# EAGLE design SensX3N (EAGLE 8.1.1)
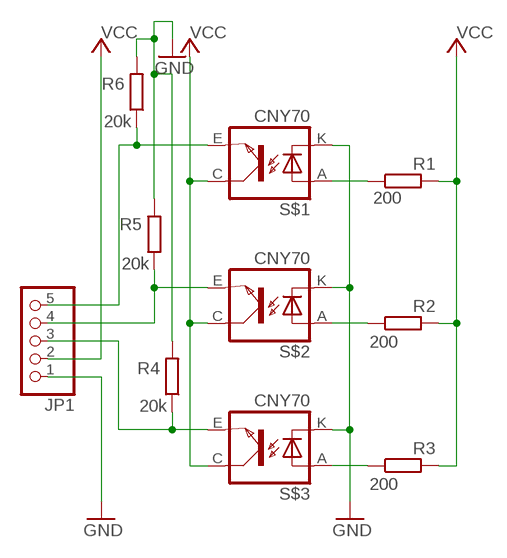
[diagram p0: schematic, sheet 1]

## Parts
JP1  PINHD-1X5  [1X05]
R1  200  R-EU_R0805  [R0805]
R2  200  R-EU_R0805  [R0805]
R3  200  R-EU_R0805  [R0805]
R4  20k  R-EU_R0805  [R0805]
R5  20k  R-EU_R0805  [R0805]
R6  20k  R-EU_R0805  [R0805]
S$1  CNY70  [4]
S$2  CNY70  [4]
S$3  CNY70  [4]

## Nets
GND: JP1.1 R4.2 R5.2 R6.2 S$1.K(C) S$2.K(C) S$3.K(C)
N$1: JP1.5 R6.1 S$1.E(EMI)
N$2: JP1.4 R5.1 S$2.E(EMI)
N$3: JP1.3 R4.1 S$3.E(EMI)
N$8: R2.1 S$2.A
N$9: R1.1 S$1.A
N$11: R3.1 S$3.A
VCC: JP1.2 R1.2 R2.2 R3.2 S$1.C(COL) S$2.C(COL) S$3.C(COL)

## Library data of the parts
JP1 = pinhead:PINHD-1X5: PIN HEADER
R1-R6 = resistor:R-EU_: RESISTOR, European symbol
S$1-S$3 = cny70:CNY70

## Board
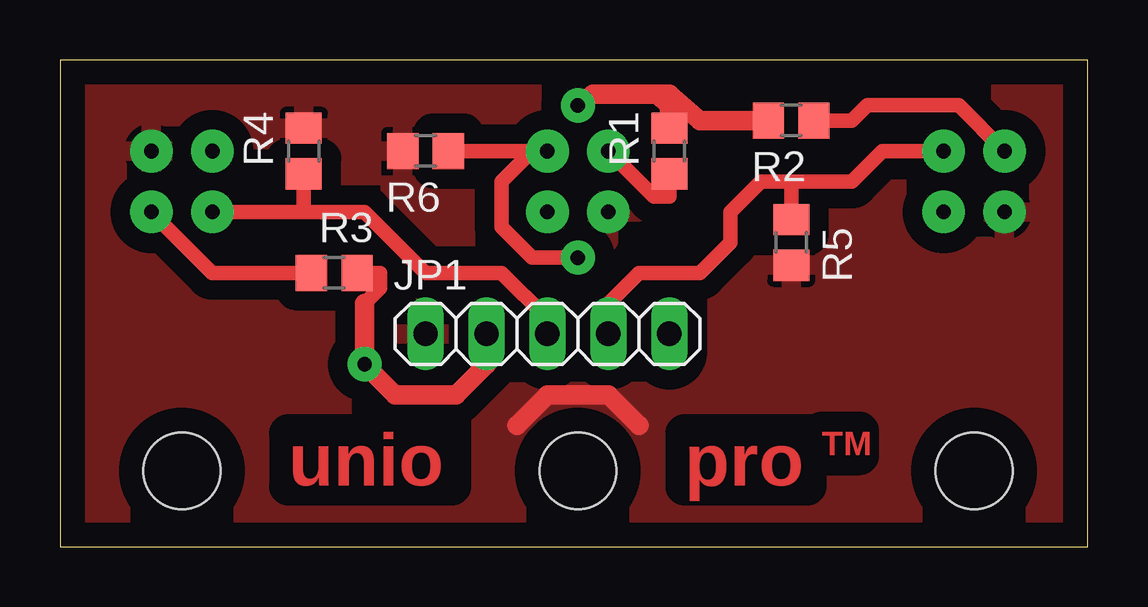
[diagram p1: board, top side]
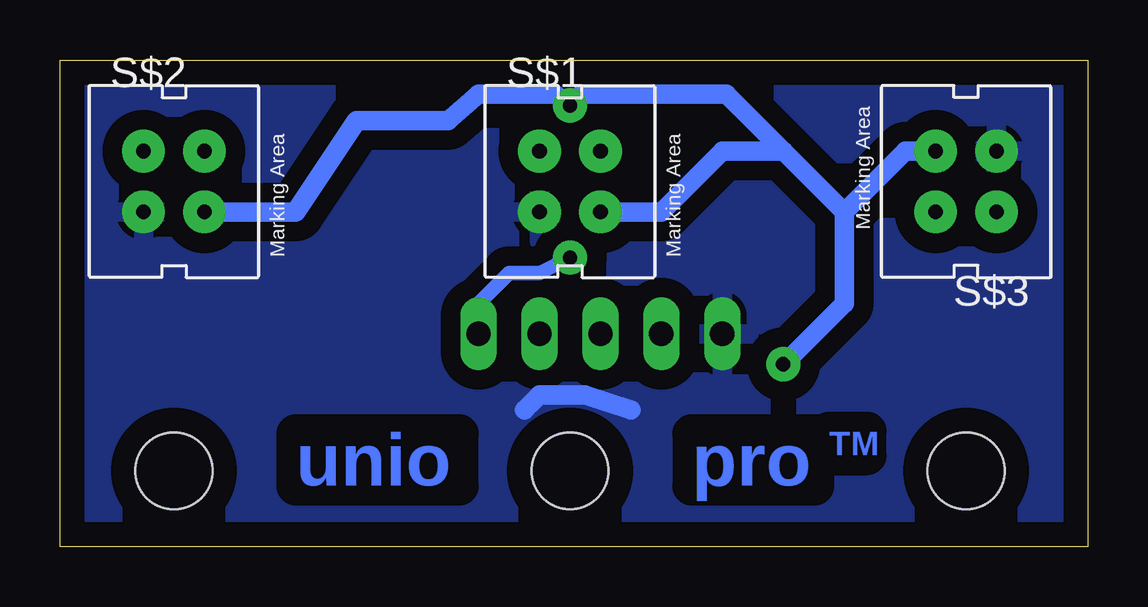
[diagram p2: board, bottom side, seen from below]

Size 42.85 x 20.31 mm. Coordinates in mm from the lower left corner, seen from the top.
Outline: 0,0 42.85,0 42.85,20.31 0,20.31 0,0
Copper layers (1*16): Top 0.035mm / dielectric 1.5mm / Bottom 0.035mm
Design rules "default": minimum track width 10mil, minimum drill 24mil, track to track 8mil, track to pad 8mil, pad to pad 8mil, via to via 8mil, smd to smd 8mil, copper to edge 40mil, drill to drill 8mil, minimum pad ring 10mil, minimum via ring 8mil, stop-mask expansion 4mil, vias tented up to drill 0mil, thermal gap 10mil
Holes 3.2 mm at 5.08,3.17 21.59,3.17 38.1,3.17

### Footprints (pad centres in the part's own frame; a part is rotated, then mirrored left to right if it is on the bottom)
1X05 = drill 1.016 long: 1 -5.08,0; 2 -2.54,0; 3 0,0; 4 2.54,0; 5 5.08,0
R0805 = smd 1.3 x 1.5: 1 -0.95,0; 2 0.95,0
4 = drill 0.61 pad 1.778: A -1.27,1.27; C 1.27,-1.27; E 1.27,1.27; K -1.27,-1.27

### Placement (x,y rotation side)
JP1  20.32,8.89 0 top
R1  25.4,16.51 90 top
R2  30.48,17.78 180 top
R3  11.43,11.43 0 top
R4  10.16,16.51 90 top
R5  30.48,12.7 270 top
R6  15.24,16.51 180 top
S$1  21.59,15.24 0 bottom
S$2  38.1,15.24 0 bottom
S$3  5.08,15.24 180 bottom

### Tracks (layer width: path | path; a pad name or v marks a point on that pad's centre or on a via)
GND
  Top 0.813: 19.05,5.08 20.32,6.35 22.86,6.35 24.13,5.08
  Bottom 0.813: 19.05,5.71 20.95,6.35 22.86,6.35 23.5,5.71
  pour Bottom (isolate 0.813): 0,20.32 43.18,20.32 43.18,0 0,0
  pour Top (isolate 0.813): 0,20.32 43.18,20.32 43.18,0 0,0
N$1  (via drill 0.6 pad 1.42)
  Top 0.61: v21.59,12.06 19.68,12.06 18.41,13.34 18.41,15.24 19.68,16.51 | 19.68,16.51 S$1.E | 19.68,16.51 R6.1
  Bottom 0.61: JP1.5 25.4,10.16 24.13,11.43 22.86,11.43 v21.59,12.06
N$2
  Top 0.61: JP1.4 22.86,10.16 24.13,11.43 26.67,11.43 27.94,12.7 27.94,13.97 29.21,15.24 30.48,15.24 | S$2.E 34.29,16.51 33.02,15.24 30.48,15.24 | R5.1 30.48,15.24
N$3
  Top 0.61: JP1.3 20.32,9.53 18.41,11.43 15.24,11.43 12.7,13.97 10.16,13.97 | S$3.E 10.16,13.97 | 10.16,13.97 R4.1
N$8
  Top 0.61: R2.1 33.02,17.78 33.66,18.41 37.47,18.41 S$2.A
N$9
  Top 0.61: R1.1 25.24,15.4 25.4,15.24 25.4,14.61 24.77,14.61 S$1.A
N$11
  Top 0.61: S$3.A 6.35,11.43 R3.1
VCC  (via drill 0.6 pad 1.42)
  Top 0.61: R3.2 13.34,11.43 13.34,10.79 12.7,10.16 | R1.2 25.4,18.25 24.77,18.89
  Top 0.813: JP1.2 17.78,7.62 16.51,6.35 13.97,6.35 v12.7,7.62 12.7,10.16 | 29.21,17.78 R2.2 26.67,17.78 25.4,18.89 | 25.4,18.89 R1.2 | 25.4,18.89 24.77,18.89 22.23,18.89 v21.59,18.41
  Bottom 0.813: S$3.C 7.62,16.51 10.16,13.97 | 10.16,13.97 10.16,10.16 v12.7,7.62 | S$2.C 33.02,13.97 30.48,17.78 26.67,17.78 25.4,18.89 22.23,18.89 v21.59,18.41 21.12,18.89 15.08,18.89 12.7,16.51 | 12.7,16.51 10.16,13.97 | 12.7,16.51 15.24,16.51 17.78,13.97 S$1.C

### Text on the board
Top: TM | unio | pro
Bottom: TM | pro | unio